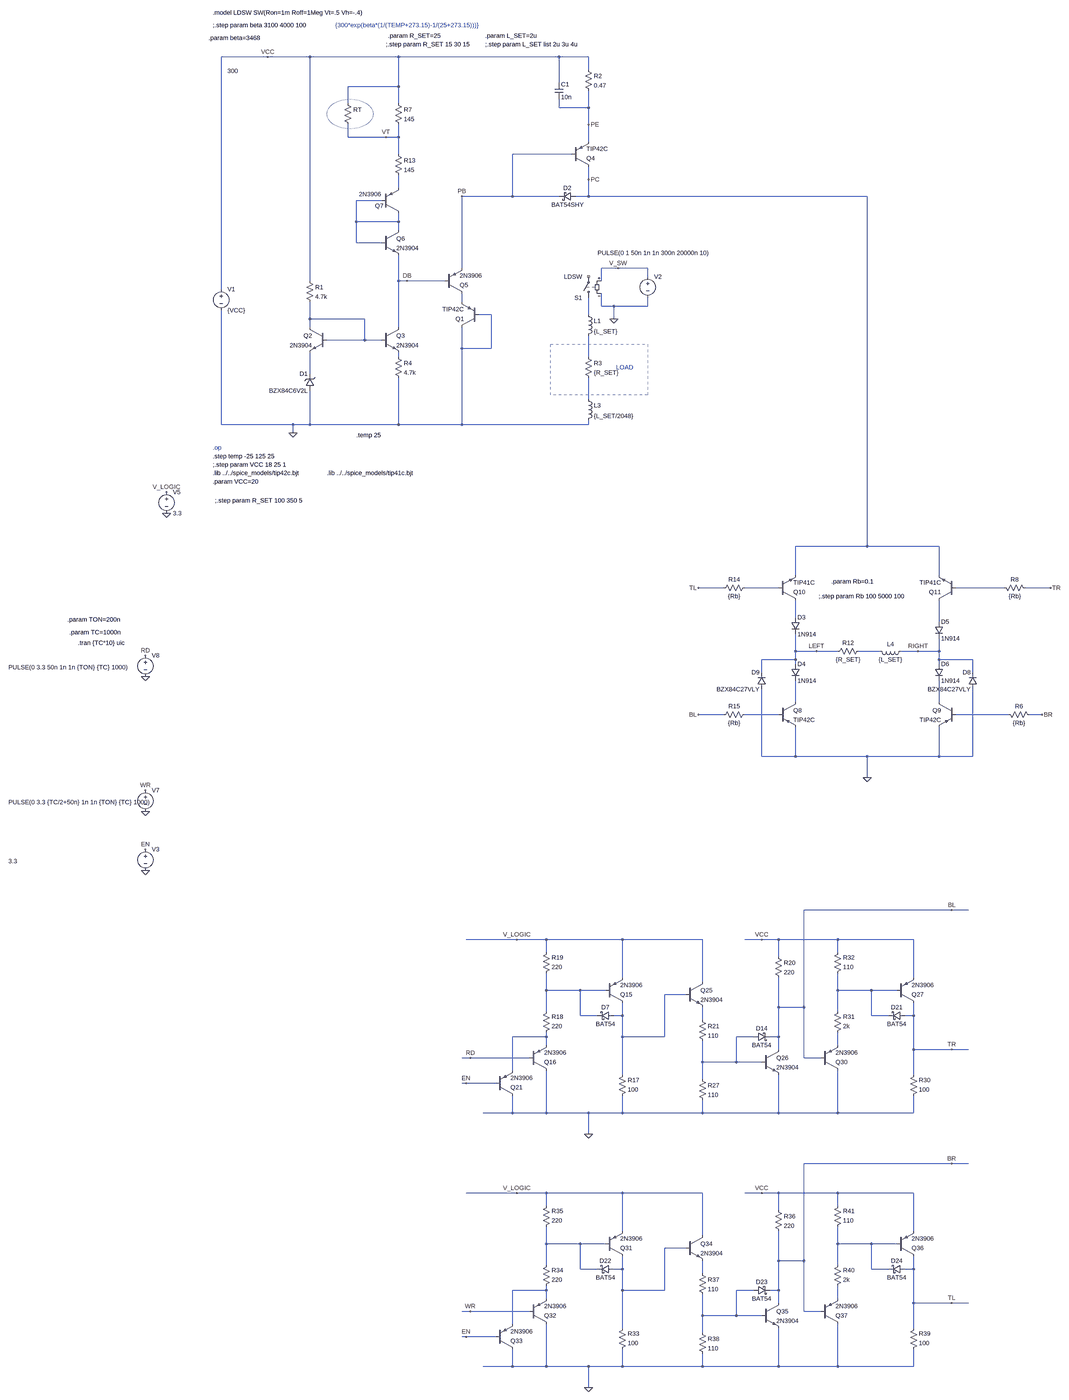
[diagram p0: schematic line_switch.asc, whole sheet]
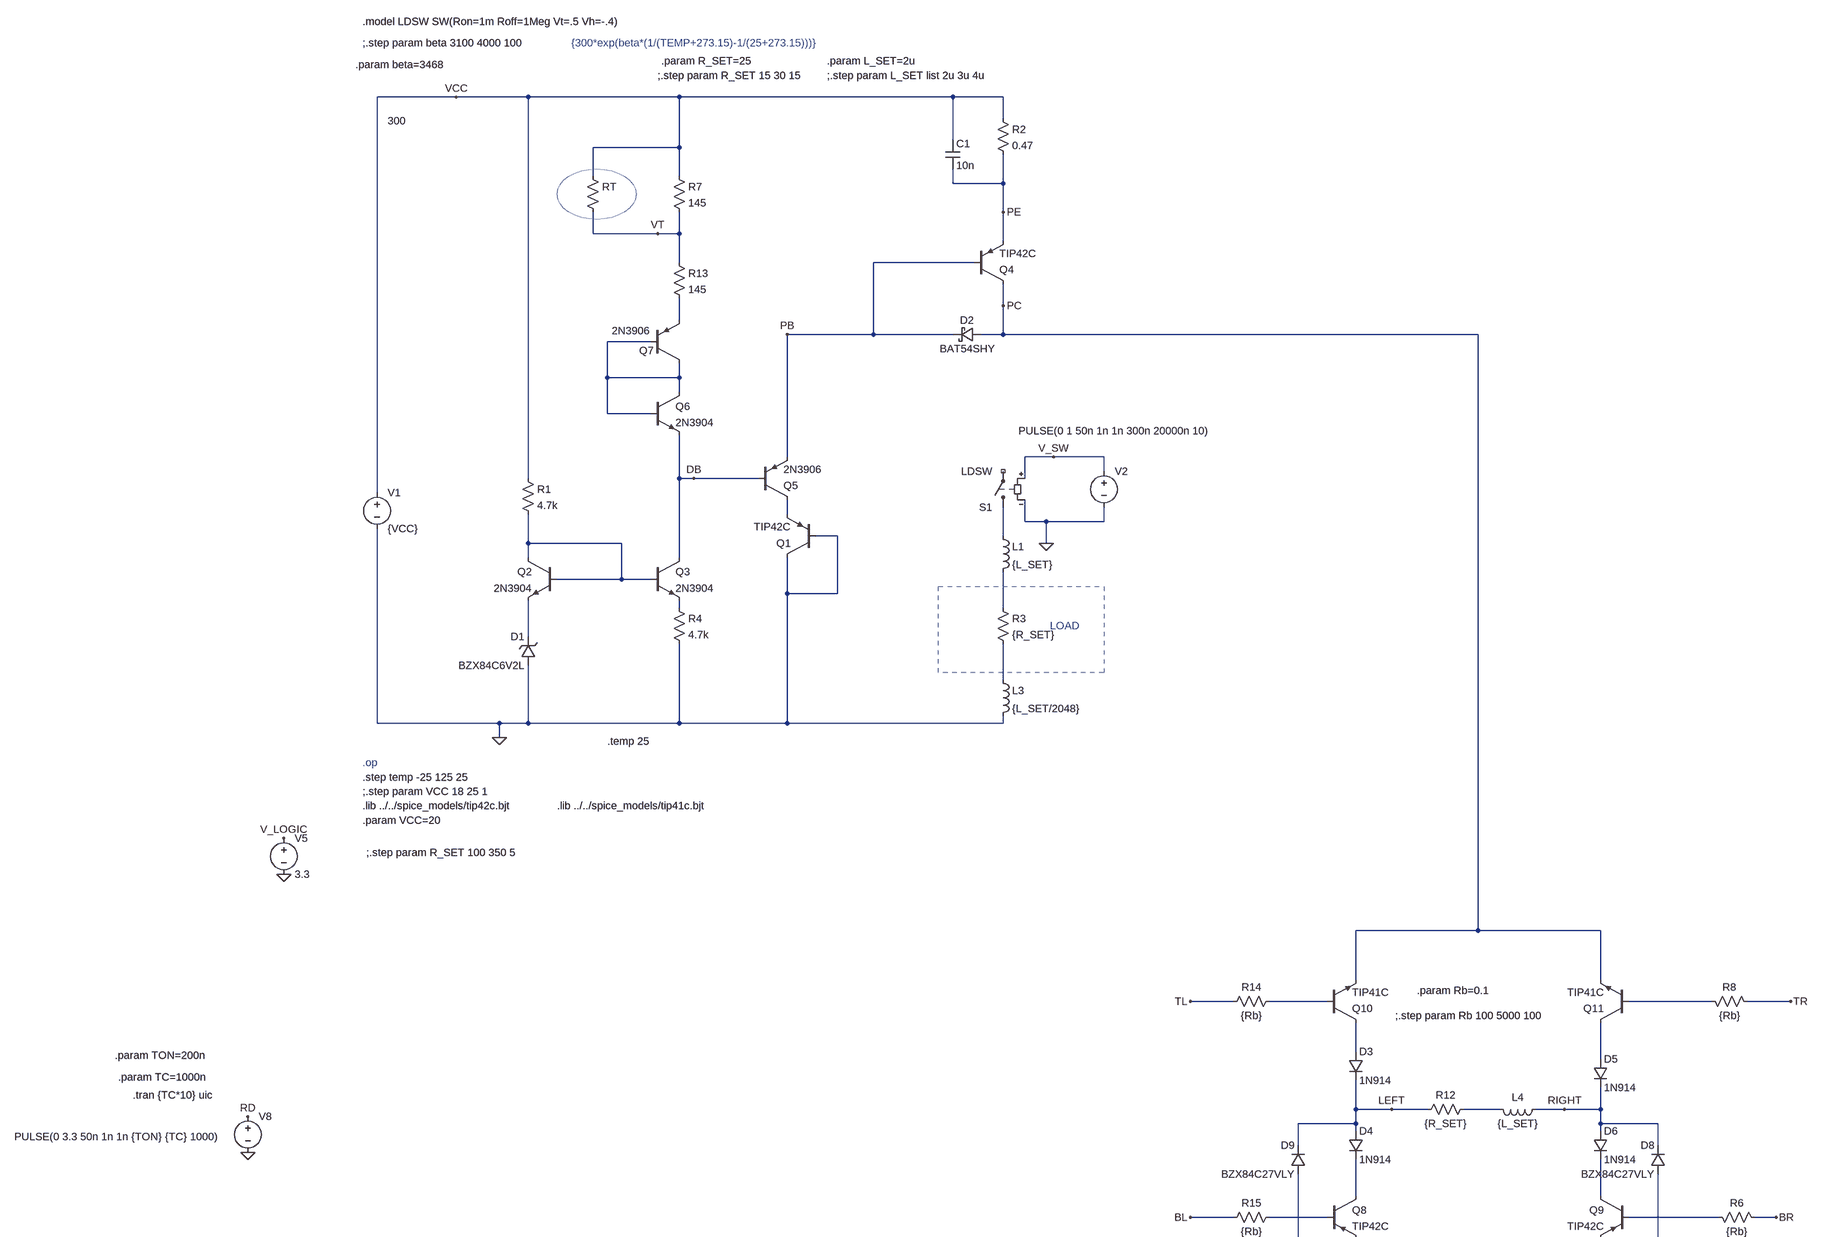
[diagram p1: schematic line_switch.asc, part, row 1 of 2, column 1 of 1]
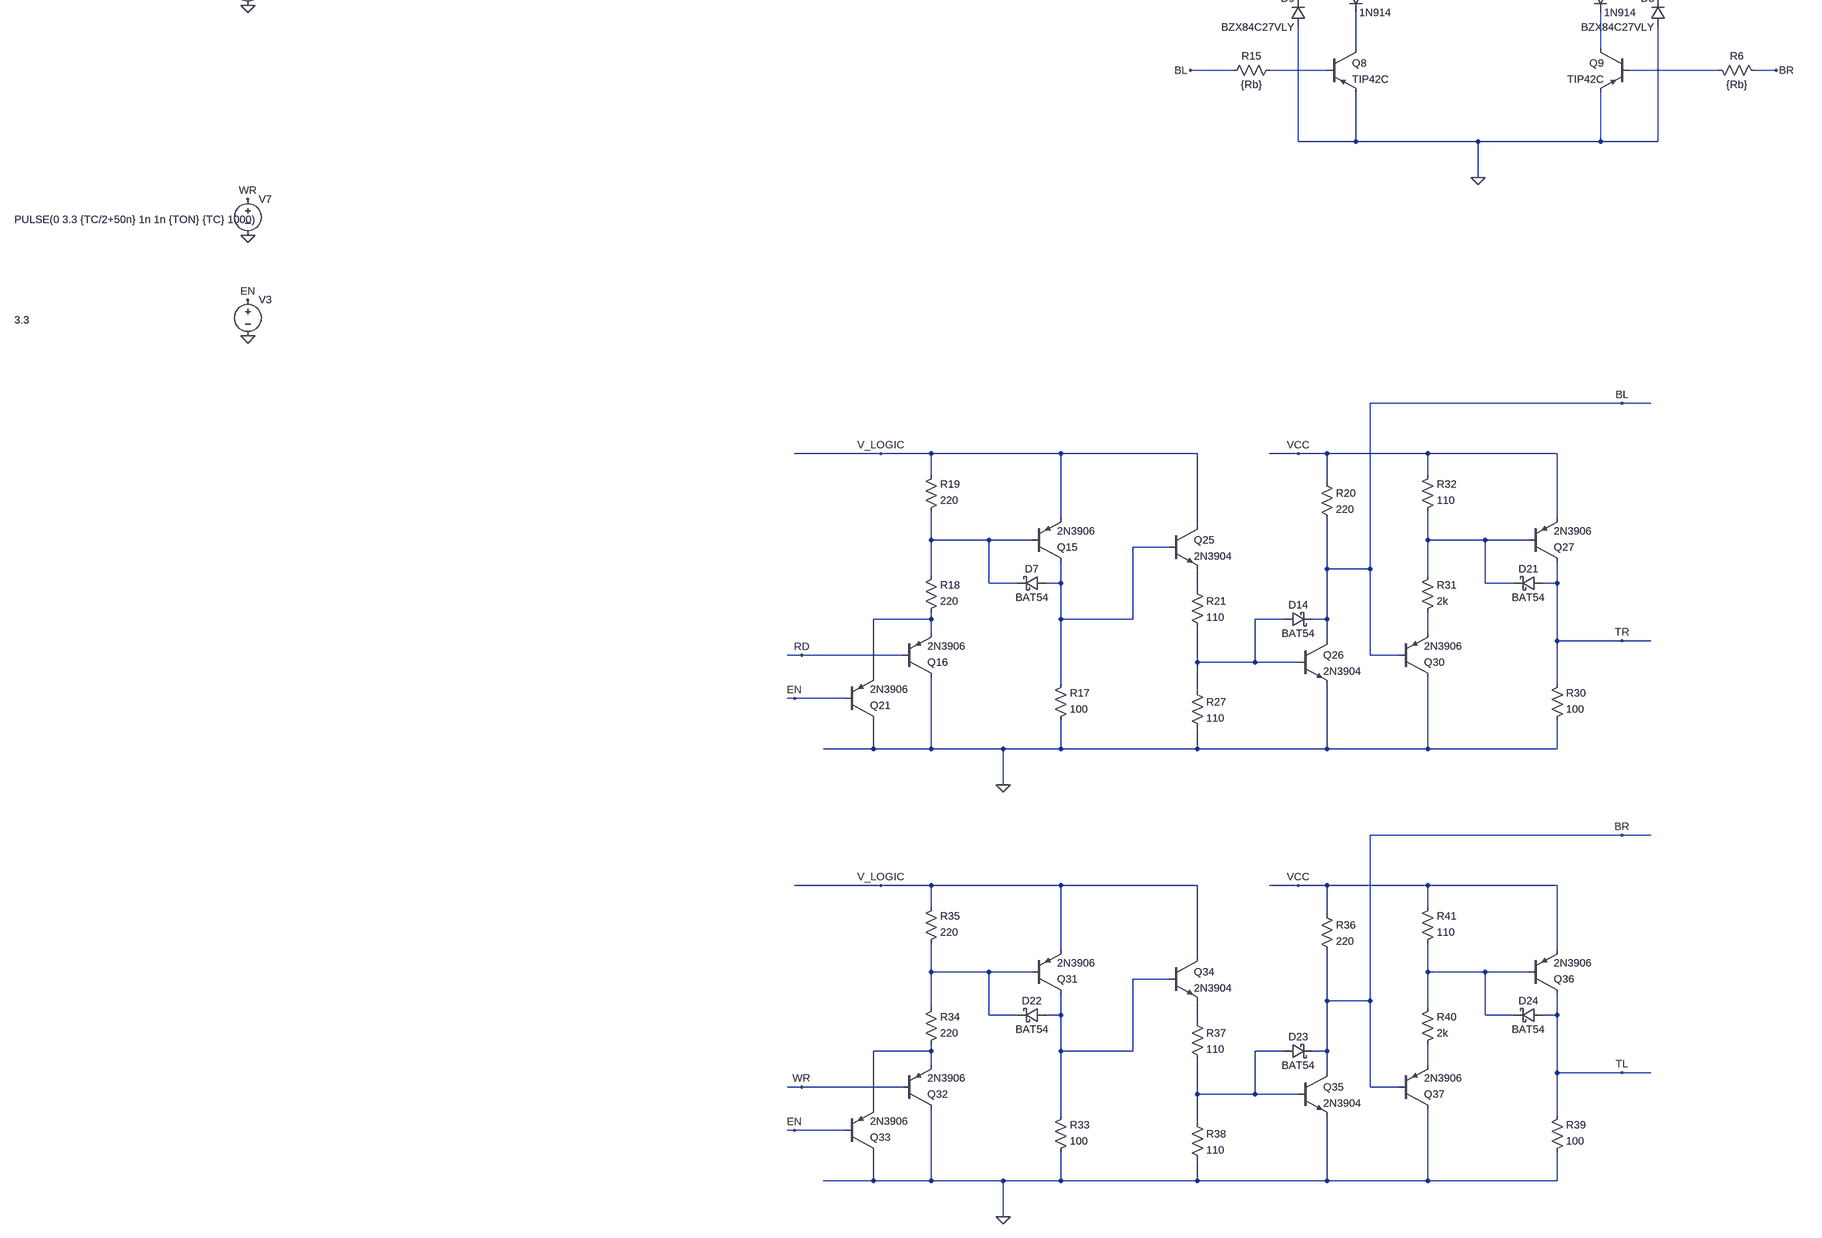
[diagram p2: schematic line_switch.asc, part, row 2 of 2, column 1 of 1]
line_switch.asc, the LTspice schematic file:
Version 4
SHEET 1 4220 5156
WIRE -2416 -1376 -2592 -1376
WIRE -2256 -1376 -2416 -1376
WIRE -1920 -1376 -2256 -1376
WIRE -1312 -1376 -1920 -1376
WIRE -1200 -1376 -1312 -1376
WIRE -1200 -1328 -1200 -1376
WIRE -1312 -1280 -1312 -1376
WIRE -1920 -1264 -1920 -1376
WIRE -1920 -1264 -2112 -1264
WIRE -2112 -1200 -2112 -1264
WIRE -1920 -1200 -1920 -1264
WIRE -1312 -1184 -1312 -1216
WIRE -1200 -1184 -1200 -1248
WIRE -1200 -1184 -1312 -1184
WIRE -1200 -1120 -1200 -1184
WIRE -2112 -1072 -2112 -1120
WIRE -1968 -1072 -2112 -1072
WIRE -1920 -1072 -1920 -1120
WIRE -1920 -1072 -1968 -1072
WIRE -1200 -1056 -1200 -1120
WIRE -1920 -1008 -1920 -1072
WIRE -1264 -1008 -1488 -1008
WIRE -1200 -912 -1200 -960
WIRE -1920 -880 -1920 -928
WIRE -1488 -848 -1488 -1008
WIRE -1488 -848 -1680 -848
WIRE -1312 -848 -1488 -848
WIRE -1200 -848 -1200 -912
WIRE -1200 -848 -1248 -848
WIRE -144 -848 -1200 -848
WIRE -1984 -832 -2080 -832
WIRE -2080 -752 -2080 -832
WIRE -1920 -752 -1920 -784
WIRE -1920 -752 -2080 -752
WIRE -1920 -720 -1920 -752
WIRE -2080 -672 -2080 -752
WIRE -1984 -672 -2080 -672
WIRE -1680 -576 -1680 -848
WIRE -1088 -576 -1152 -576
WIRE -976 -576 -1088 -576
WIRE -976 -544 -976 -576
WIRE -2256 -528 -2256 -1376
WIRE -1920 -528 -1920 -624
WIRE -1888 -528 -1920 -528
WIRE -1744 -528 -1888 -528
WIRE -1152 -528 -1152 -576
WIRE -2592 -496 -2592 -1376
WIRE -1680 -448 -1680 -480
WIRE -1152 -432 -1152 -480
WIRE -1104 -432 -1152 -432
WIRE -976 -432 -976 -464
WIRE -976 -432 -1104 -432
WIRE -1568 -400 -1616 -400
WIRE -1200 -400 -1200 -464
WIRE -2256 -384 -2256 -448
WIRE -2048 -384 -2256 -384
WIRE -1104 -384 -1104 -432
WIRE -2256 -352 -2256 -384
WIRE -1920 -352 -1920 -528
WIRE -2048 -304 -2048 -384
WIRE -2048 -304 -2192 -304
WIRE -1984 -304 -2048 -304
WIRE -1680 -272 -1680 -352
WIRE -1568 -272 -1568 -400
WIRE -1568 -272 -1680 -272
WIRE -1920 -240 -1920 -256
WIRE -1200 -240 -1200 -320
WIRE -2256 -176 -2256 -256
WIRE -1200 -80 -1200 -160
WIRE -2592 16 -2592 -416
WIRE -2320 16 -2592 16
WIRE -2256 16 -2256 -112
WIRE -2256 16 -2320 16
WIRE -1920 16 -1920 -160
WIRE -1920 16 -2256 16
WIRE -1680 16 -1680 -272
WIRE -1680 16 -1920 16
WIRE -1200 16 -1200 0
WIRE -1200 16 -1680 16
WIRE -2320 48 -2320 16
WIRE -144 1072 -144 -848
WIRE -144 1072 -416 1072
WIRE 128 1072 -144 1072
WIRE -416 1200 -416 1072
WIRE 128 1200 128 1072
WIRE -688 1248 -784 1248
WIRE -480 1248 -608 1248
WIRE 400 1248 192 1248
WIRE 576 1248 480 1248
WIRE -416 1360 -416 1296
WIRE 128 1376 128 1296
WIRE -416 1488 -416 1424
WIRE -336 1488 -416 1488
WIRE -256 1488 -336 1488
WIRE -96 1488 -176 1488
WIRE 48 1488 -16 1488
WIRE 128 1488 128 1440
WIRE 128 1488 48 1488
WIRE -416 1520 -416 1488
WIRE -416 1520 -544 1520
WIRE 128 1520 128 1488
WIRE 256 1520 128 1520
WIRE -416 1536 -416 1520
WIRE 128 1536 128 1520
WIRE -544 1568 -544 1520
WIRE 256 1568 256 1520
WIRE -416 1680 -416 1600
WIRE 128 1680 128 1600
WIRE -688 1728 -784 1728
WIRE -480 1728 -608 1728
WIRE 416 1728 192 1728
WIRE 544 1728 496 1728
WIRE -544 1888 -544 1632
WIRE -416 1888 -416 1776
WIRE -416 1888 -544 1888
WIRE -144 1888 -416 1888
WIRE 128 1888 128 1776
WIRE 128 1888 -144 1888
WIRE 256 1888 256 1632
WIRE 256 1888 128 1888
WIRE -144 1968 -144 1888
WIRE 176 3328 -384 3328
WIRE 240 3328 176 3328
WIRE -1472 3440 -1664 3440
WIRE -1360 3440 -1472 3440
WIRE -1072 3440 -1360 3440
WIRE -768 3440 -1072 3440
WIRE -544 3440 -608 3440
WIRE -480 3440 -544 3440
WIRE -256 3440 -480 3440
WIRE 32 3440 -256 3440
WIRE -1360 3488 -1360 3440
WIRE -256 3488 -256 3440
WIRE -480 3504 -480 3440
WIRE -1072 3584 -1072 3440
WIRE 32 3584 32 3440
WIRE -768 3600 -768 3440
WIRE -1360 3632 -1360 3568
WIRE -1232 3632 -1360 3632
WIRE -1136 3632 -1232 3632
WIRE -256 3632 -256 3568
WIRE -128 3632 -256 3632
WIRE -32 3632 -128 3632
WIRE -832 3648 -912 3648
WIRE -480 3696 -480 3584
WIRE -384 3696 -384 3328
WIRE -384 3696 -480 3696
WIRE -1360 3712 -1360 3632
WIRE -256 3712 -256 3632
WIRE -1232 3728 -1232 3632
WIRE -1168 3728 -1232 3728
WIRE -1072 3728 -1072 3680
WIRE -1072 3728 -1104 3728
WIRE -128 3728 -128 3632
WIRE -64 3728 -128 3728
WIRE 32 3728 32 3680
WIRE 32 3728 0 3728
WIRE -768 3744 -768 3696
WIRE -1360 3808 -1360 3792
WIRE -1360 3808 -1488 3808
WIRE -1072 3808 -1072 3728
WIRE -912 3808 -912 3648
WIRE -912 3808 -1072 3808
WIRE -576 3808 -640 3808
WIRE -480 3808 -480 3696
WIRE -480 3808 -512 3808
WIRE -1360 3840 -1360 3808
WIRE -256 3840 -256 3792
WIRE -480 3856 -480 3808
WIRE 32 3856 32 3728
WIRE 176 3856 32 3856
WIRE 240 3856 176 3856
WIRE -1648 3888 -1680 3888
WIRE -1424 3888 -1648 3888
WIRE -384 3888 -384 3696
WIRE -320 3888 -384 3888
WIRE -768 3904 -768 3824
WIRE -640 3904 -640 3808
WIRE -640 3904 -768 3904
WIRE -544 3904 -640 3904
WIRE -1488 3936 -1488 3808
WIRE -1072 3952 -1072 3808
WIRE 32 3952 32 3856
WIRE -768 3968 -768 3904
WIRE -1664 3984 -1680 3984
WIRE -1552 3984 -1664 3984
WIRE -1488 4096 -1488 4032
WIRE -1488 4096 -1600 4096
WIRE -1360 4096 -1360 3936
WIRE -1360 4096 -1488 4096
WIRE -1200 4096 -1360 4096
WIRE -1072 4096 -1072 4032
WIRE -1072 4096 -1200 4096
WIRE -768 4096 -768 4048
WIRE -768 4096 -1072 4096
WIRE -480 4096 -480 3952
WIRE -480 4096 -768 4096
WIRE -256 4096 -256 3936
WIRE -256 4096 -480 4096
WIRE 32 4096 32 4032
WIRE 32 4096 -256 4096
WIRE -1200 4176 -1200 4096
WIRE 176 4288 -384 4288
WIRE 240 4288 176 4288
WIRE -1472 4400 -1664 4400
WIRE -1360 4400 -1472 4400
WIRE -1072 4400 -1360 4400
WIRE -768 4400 -1072 4400
WIRE -544 4400 -608 4400
WIRE -480 4400 -544 4400
WIRE -256 4400 -480 4400
WIRE 32 4400 -256 4400
WIRE -1360 4448 -1360 4400
WIRE -256 4448 -256 4400
WIRE -480 4464 -480 4400
WIRE -1072 4544 -1072 4400
WIRE 32 4544 32 4400
WIRE -768 4560 -768 4400
WIRE -1360 4592 -1360 4528
WIRE -1232 4592 -1360 4592
WIRE -1136 4592 -1232 4592
WIRE -256 4592 -256 4528
WIRE -128 4592 -256 4592
WIRE -32 4592 -128 4592
WIRE -832 4608 -912 4608
WIRE -480 4656 -480 4544
WIRE -384 4656 -384 4288
WIRE -384 4656 -480 4656
WIRE -1360 4672 -1360 4592
WIRE -256 4672 -256 4592
WIRE -1232 4688 -1232 4592
WIRE -1168 4688 -1232 4688
WIRE -1072 4688 -1072 4640
WIRE -1072 4688 -1104 4688
WIRE -128 4688 -128 4592
WIRE -64 4688 -128 4688
WIRE 32 4688 32 4640
WIRE 32 4688 0 4688
WIRE -768 4704 -768 4656
WIRE -1360 4768 -1360 4752
WIRE -1360 4768 -1488 4768
WIRE -1072 4768 -1072 4688
WIRE -912 4768 -912 4608
WIRE -912 4768 -1072 4768
WIRE -576 4768 -640 4768
WIRE -480 4768 -480 4656
WIRE -480 4768 -512 4768
WIRE -1360 4800 -1360 4768
WIRE -256 4800 -256 4752
WIRE -480 4816 -480 4768
WIRE 32 4816 32 4688
WIRE 176 4816 32 4816
WIRE 240 4816 176 4816
WIRE -1648 4848 -1680 4848
WIRE -1424 4848 -1648 4848
WIRE -384 4848 -384 4656
WIRE -320 4848 -384 4848
WIRE -768 4864 -768 4784
WIRE -640 4864 -640 4768
WIRE -640 4864 -768 4864
WIRE -544 4864 -640 4864
WIRE -1488 4896 -1488 4768
WIRE -1072 4912 -1072 4768
WIRE 32 4912 32 4816
WIRE -768 4928 -768 4864
WIRE -1664 4944 -1680 4944
WIRE -1552 4944 -1664 4944
WIRE -1488 5056 -1488 4992
WIRE -1488 5056 -1600 5056
WIRE -1360 5056 -1360 4896
WIRE -1360 5056 -1488 5056
WIRE -1200 5056 -1360 5056
WIRE -1072 5056 -1072 4992
WIRE -1072 5056 -1200 5056
WIRE -768 5056 -768 5008
WIRE -768 5056 -1072 5056
WIRE -480 5056 -480 4912
WIRE -480 5056 -768 5056
WIRE -256 5056 -256 4896
WIRE -256 5056 -480 5056
WIRE 32 5056 32 4992
WIRE 32 5056 -256 5056
WIRE -1200 5136 -1200 5056
FLAG -2320 48 0
FLAG -1200 -1120 PE
FLAG -1200 -912 PC
FLAG -1968 -1072 VT
FLAG -2416 -1376 VCC
FLAG -1680 -848 PB
FLAG -1888 -528 DB
FLAG -1104 -384 0
FLAG -1088 -576 V_SW
FLAG -144 1968 0
FLAG -2976 352 0
FLAG -2976 272 V_LOGIC
FLAG -3056 2016 WR
FLAG -3056 2096 0
FLAG -3056 1504 RD
FLAG -3056 1584 0
FLAG -3056 2240 EN
FLAG -3056 2320 0
FLAG -1648 3888 RD
FLAG -1472 3440 V_LOGIC
FLAG -1664 3984 EN
FLAG -544 3440 VCC
FLAG -1200 4176 0
FLAG 176 3328 BL
FLAG 176 3856 TR
FLAG -1648 4848 WR
FLAG -1472 4400 V_LOGIC
FLAG -1664 4944 EN
FLAG -544 4400 VCC
FLAG -1200 5136 0
FLAG 176 4288 BR
FLAG 176 4816 TL
FLAG -784 1248 TL
FLAG -784 1728 BL
FLAG 576 1248 TR
FLAG 544 1728 BR
FLAG -336 1488 LEFT
FLAG 48 1488 RIGHT
SYMBOL npn -2192 -352 M0
SYMATTR InstName Q2
SYMATTR Value 2N3904
SYMBOL zener -2240 -112 R180
WINDOW 0 24 64 Left 2
WINDOW 3 24 0 Left 2
SYMATTR InstName D1
SYMATTR Value BZX84C6V2L
SYMBOL res -2272 -544 R0
SYMATTR InstName R1
SYMATTR Value 4.7k
SYMBOL res -1216 -1344 R0
SYMATTR InstName R2
SYMATTR Value 0.47
SYMBOL res -1216 -256 R0
SYMATTR InstName R3
SYMATTR Value {R_SET}
SYMBOL voltage -2592 -512 R0
SYMATTR InstName V1
SYMATTR Value {VCC}
SYMBOL npn -1984 -352 R0
SYMATTR InstName Q3
SYMATTR Value 2N3904
SYMBOL res -1936 -256 R0
SYMATTR InstName R4
SYMATTR Value 4.7k
SYMBOL pnp -1264 -960 M180
SYMATTR InstName Q4
SYMATTR Value TIP42C
SYMBOL pnp -1744 -480 M180
SYMATTR InstName Q5
SYMATTR Value 2N3906
SYMBOL pnp -1984 -784 M180
WINDOW 0 -25 28 Left 2
WINDOW 3 -86 72 Left 2
SYMATTR InstName Q7
SYMATTR Value 2N3906
SYMBOL npn -1984 -720 R0
SYMATTR InstName Q6
SYMATTR Value 2N3904
SYMBOL res -1936 -1216 R0
SYMATTR InstName R7
SYMATTR Value 145
SYMBOL res -1936 -1024 R0
SYMATTR InstName R13
SYMATTR Value 145
SYMBOL res -2128 -1216 R0
WINDOW 3 -440 -107 Left 2
SYMATTR Value 300
SYMATTR InstName RT
SYMBOL pnp -1616 -352 R180
SYMATTR InstName Q1
SYMATTR Value TIP42C
SYMBOL sw -1200 -448 R180
SYMATTR InstName S1
SYMATTR Value LDSW
SYMBOL voltage -976 -560 R0
WINDOW 123 0 0 Left 0
WINDOW 39 0 0 Left 0
WINDOW 3 -190 -74 Left 2
SYMATTR Value PULSE(0 1 50n 1n 1n 300n 20000n 10)
SYMATTR InstName V2
SYMBOL schottky -1248 -864 R90
WINDOW 0 0 32 VBottom 2
WINDOW 3 32 32 VTop 2
SYMATTR InstName D2
SYMATTR Value BAT54SHY
SYMATTR Description Diode
SYMATTR Type diode
SYMBOL ind -1216 -416 R0
SYMATTR InstName L1
SYMATTR Value {L_SET}
SYMBOL ind -1216 -96 R0
SYMATTR InstName L3
SYMATTR Value {L_SET/2048}
SYMBOL res -160 1472 R90
WINDOW 0 0 56 VBottom 2
WINDOW 3 32 56 VTop 2
SYMATTR InstName R12
SYMATTR Value {R_SET}
SYMBOL ind 0 1472 R90
WINDOW 0 5 56 VBottom 2
WINDOW 3 32 56 VTop 2
SYMATTR InstName L4
SYMATTR Value {L_SET}
SYMBOL res -592 1712 R90
WINDOW 0 0 56 VBottom 2
WINDOW 3 32 56 VTop 2
SYMATTR InstName R15
SYMATTR Value {Rb}
SYMBOL res -592 1232 R90
WINDOW 0 0 56 VBottom 2
WINDOW 3 32 56 VTop 2
SYMATTR InstName R14
SYMATTR Value {Rb}
SYMBOL voltage -2976 256 R0
SYMATTR InstName V5
SYMATTR Value 3.3
SYMBOL voltage -3056 2000 R0
WINDOW 123 0 0 Left 0
WINDOW 39 0 0 Left 0
WINDOW 3 -519 61 Left 2
SYMATTR Value PULSE(0 3.3 {TC/2+50n} 1n 1n {TON} {TC} 1000)
SYMATTR InstName V7
SYMBOL voltage -3056 1488 R0
WINDOW 123 0 0 Left 0
WINDOW 39 0 0 Left 0
WINDOW 3 -519 61 Left 2
SYMATTR Value PULSE(0 3.3 50n 1n 1n {TON} {TC} 1000)
SYMATTR InstName V8
SYMBOL voltage -3056 2224 R0
WINDOW 123 0 0 Left 0
WINDOW 39 0 0 Left 0
WINDOW 3 -519 61 Left 2
SYMATTR Value 3.3
SYMATTR InstName V3
SYMBOL res 400 1712 M90
WINDOW 0 0 56 VBottom 2
WINDOW 3 32 56 VTop 2
SYMATTR InstName R6
SYMATTR Value {Rb}
SYMBOL res 384 1232 M90
WINDOW 0 0 56 VBottom 2
WINDOW 3 32 56 VTop 2
SYMATTR InstName R8
SYMATTR Value {Rb}
SYMBOL schottky -1104 3744 M270
WINDOW 0 32 32 VTop 2
WINDOW 3 0 32 VBottom 2
SYMATTR InstName D7
SYMATTR Value BAT54
SYMATTR Description Diode
SYMATTR Type diode
SYMBOL res -1088 4048 M180
WINDOW 0 36 76 Left 2
WINDOW 3 36 40 Left 2
SYMATTR InstName R17
SYMATTR Value 100
SYMBOL res -1376 3808 M180
WINDOW 0 36 76 Left 2
WINDOW 3 36 40 Left 2
SYMATTR InstName R18
SYMATTR Value 220
SYMBOL res -1376 3584 M180
WINDOW 0 36 76 Left 2
WINDOW 3 36 40 Left 2
SYMATTR InstName R19
SYMATTR Value 220
SYMBOL pnp -1136 3680 M180
SYMATTR InstName Q15
SYMATTR Value 2N3906
SYMBOL pnp -1424 3936 M180
SYMATTR InstName Q16
SYMATTR Value 2N3906
SYMBOL pnp -1552 4032 M180
SYMATTR InstName Q21
SYMATTR Value 2N3906
SYMBOL schottky -576 3792 M90
WINDOW 0 0 32 VBottom 2
WINDOW 3 32 32 VTop 2
SYMATTR InstName D14
SYMATTR Value BAT54
SYMATTR Description Diode
SYMATTR Type diode
SYMBOL res -496 3488 R0
SYMATTR InstName R20
SYMATTR Value 220
SYMBOL res -784 3728 R0
SYMATTR InstName R21
SYMATTR Value 110
SYMBOL res -784 3952 R0
SYMATTR InstName R27
SYMATTR Value 110
SYMBOL npn -832 3600 R0
SYMATTR InstName Q25
SYMATTR Value 2N3904
SYMBOL npn -544 3856 R0
SYMATTR InstName Q26
SYMATTR Value 2N3904
SYMBOL schottky 0 3744 M270
WINDOW 0 32 32 VTop 2
WINDOW 3 0 32 VBottom 2
SYMATTR InstName D21
SYMATTR Value BAT54
SYMATTR Description Diode
SYMATTR Type diode
SYMBOL res 16 4048 M180
WINDOW 0 36 76 Left 2
WINDOW 3 36 40 Left 2
SYMATTR InstName R30
SYMATTR Value 100
SYMBOL res -272 3808 M180
WINDOW 0 36 76 Left 2
WINDOW 3 36 40 Left 2
SYMATTR InstName R31
SYMATTR Value 2k
SYMBOL res -272 3584 M180
WINDOW 0 36 76 Left 2
WINDOW 3 36 40 Left 2
SYMATTR InstName R32
SYMATTR Value 110
SYMBOL pnp -32 3680 M180
SYMATTR InstName Q27
SYMATTR Value 2N3906
SYMBOL pnp -320 3936 M180
SYMATTR InstName Q30
SYMATTR Value 2N3906
SYMBOL schottky -1104 4704 M270
WINDOW 0 32 32 VTop 2
WINDOW 3 0 32 VBottom 2
SYMATTR InstName D22
SYMATTR Value BAT54
SYMATTR Description Diode
SYMATTR Type diode
SYMBOL res -1088 5008 M180
WINDOW 0 36 76 Left 2
WINDOW 3 36 40 Left 2
SYMATTR InstName R33
SYMATTR Value 100
SYMBOL res -1376 4768 M180
WINDOW 0 36 76 Left 2
WINDOW 3 36 40 Left 2
SYMATTR InstName R34
SYMATTR Value 220
SYMBOL res -1376 4544 M180
WINDOW 0 36 76 Left 2
WINDOW 3 36 40 Left 2
SYMATTR InstName R35
SYMATTR Value 220
SYMBOL pnp -1136 4640 M180
SYMATTR InstName Q31
SYMATTR Value 2N3906
SYMBOL pnp -1424 4896 M180
SYMATTR InstName Q32
SYMATTR Value 2N3906
SYMBOL pnp -1552 4992 M180
SYMATTR InstName Q33
SYMATTR Value 2N3906
SYMBOL schottky -576 4752 M90
WINDOW 0 0 32 VBottom 2
WINDOW 3 32 32 VTop 2
SYMATTR InstName D23
SYMATTR Value BAT54
SYMATTR Description Diode
SYMATTR Type diode
SYMBOL res -496 4448 R0
SYMATTR InstName R36
SYMATTR Value 220
SYMBOL res -784 4688 R0
SYMATTR InstName R37
SYMATTR Value 110
SYMBOL res -784 4912 R0
SYMATTR InstName R38
SYMATTR Value 110
SYMBOL npn -832 4560 R0
SYMATTR InstName Q34
SYMATTR Value 2N3904
SYMBOL npn -544 4816 R0
SYMATTR InstName Q35
SYMATTR Value 2N3904
SYMBOL schottky 0 4704 M270
WINDOW 0 32 32 VTop 2
WINDOW 3 0 32 VBottom 2
SYMATTR InstName D24
SYMATTR Value BAT54
SYMATTR Description Diode
SYMATTR Type diode
SYMBOL res 16 5008 M180
WINDOW 0 36 76 Left 2
WINDOW 3 36 40 Left 2
SYMATTR InstName R39
SYMATTR Value 100
SYMBOL res -272 4768 M180
WINDOW 0 36 76 Left 2
WINDOW 3 36 40 Left 2
SYMATTR InstName R40
SYMATTR Value 2k
SYMBOL res -272 4544 M180
WINDOW 0 36 76 Left 2
WINDOW 3 36 40 Left 2
SYMATTR InstName R41
SYMATTR Value 110
SYMBOL pnp -32 4640 M180
SYMATTR InstName Q36
SYMATTR Value 2N3906
SYMBOL pnp -320 4896 M180
SYMATTR InstName Q37
SYMATTR Value 2N3906
SYMBOL cap -1328 -1280 R0
SYMATTR InstName C1
SYMATTR Value 10n
SYMBOL diode -432 1360 R0
SYMATTR InstName D3
SYMATTR Value 1N914
SYMBOL diode -432 1536 R0
SYMATTR InstName D4
SYMATTR Value 1N914
SYMBOL diode 112 1376 R0
SYMATTR InstName D5
SYMATTR Value 1N914
SYMBOL diode 112 1536 R0
SYMATTR InstName D6
SYMATTR Value 1N914
SYMBOL diode 272 1632 R180
WINDOW 0 24 64 Left 2
WINDOW 3 24 0 Left 2
SYMATTR InstName D8
SYMATTR Value BZX84C27VLY
SYMBOL diode -528 1632 R180
WINDOW 0 24 64 Left 2
WINDOW 3 24 0 Left 2
SYMATTR InstName D9
SYMATTR Value BZX84C27VLY
SYMBOL pnp -480 1680 R0
SYMATTR InstName Q8
SYMATTR Value TIP42C
SYMBOL pnp 192 1680 M0
SYMATTR InstName Q9
SYMATTR Value TIP42C
SYMBOL npn -480 1296 M180
SYMATTR InstName Q10
SYMATTR Value TIP41C
SYMBOL npn 192 1296 R180
SYMATTR InstName Q11
SYMATTR Value TIP41C
TEXT -3312 1456 Left 2 !.tran {TC*10} uic
TEXT -2624 136 Left 2 !.step temp -25 125 25
TEXT -1096 -200 Left 2 ;LOAD
TEXT -2624 104 Left 2 ;.op
TEXT -2624 168 Left 2 !;.step param VCC 18 25 1
TEXT -2624 200 Left 2 !.lib ../../spice_models/tip42c.bjt
TEXT -2624 232 Left 2 !.param VCC=20
TEXT -2616 304 Left 2 !;.step param R_SET 100 350 5
TEXT -2640 -1448 Left 2 !.param beta=3468
TEXT -2624 -1496 Left 2 !;.step param beta 3100 4000 100
TEXT -2160 -1496 Left 2 ;{300*exp(beta*(1/(TEMP+273.15)-1/(25+273.15)))}
TEXT -1968 -1424 Left 2 !;.step param R_SET 15 30 15
TEXT -2624 -1544 Left 2 !.model LDSW SW(Ron=1m Roff=1Meg Vt=.5 Vh=-.4)
TEXT -2080 56 Left 2 !.temp 25
TEXT -1592 -1424 Left 2 !;.step param L_SET list 2u 3u 4u
TEXT -2192 200 Left 2 !.lib ../../spice_models/tip41c.bjt
TEXT -1592 -1456 Left 2 !.param L_SET=2u
TEXT -1960 -1456 Left 2 !.param R_SET=25
TEXT -280 1224 Left 2 !.param Rb=0.1
TEXT -3352 1368 Left 2 !.param TON=200n
TEXT -3344 1416 Left 2 !.param TC=1000n
TEXT -328 1280 Left 2 !;.step param Rb 100 5000 100
RECTANGLE Normal -976 -96 -1344 -288 2
CIRCLE Normal -2016 -1104 -2192 -1216 2

The netlist it stands for:
* line_switch.asc
Q2 N005 N005 N008 0 2N3904
D1 0 N008 BZX84C6V2L
R1 VCC N005 4.7k
R2 VCC PE 0.47
R3 N007 N009 {R_SET}
V1 VCC 0 {VCC}
Q3 DB N005 N006 0 2N3904
R4 N006 0 4.7k
Q4 PC PB PE 0 TIP42C
Q5 N003 DB PB 0 2N3906
Q7 N002 N002 N001 0 2N3906
Q6 N002 N002 DB 0 2N3904
R7 VCC VT 145
R13 VT N001 145
RT VCC VT 300
Q1 0 0 N003 0 TIP42C
S1 N004 NC_01 V_SW 0 LDSW
V2 V_SW 0 PULSE(0 1 50n 1n 1n 300n 20000n 10)
D2 PC PB BAT54SHY
L1 N004 N007 {L_SET}
L3 N009 0 {L_SET/2048}
R12 N014 LEFT {R_SET}
L4 RIGHT N014 {L_SET}
R15 N017 BL {Rb}
R14 N010 TL {Rb}
V5 V_LOGIC 0 3.3
V7 WR 0 PULSE(0 3.3 {TC/2+50n} 1n 1n {TON} {TC} 1000)
V8 RD 0 PULSE(0 3.3 50n 1n 1n {TON} {TC} 1000)
V3 EN 0 3.3
R6 N018 BR {Rb}
R8 N011 TR {Rb}
D7 N021 N019 BAT54
R17 0 N021 100
R18 N023 N019 220
R19 N019 V_LOGIC 220
Q15 N021 N019 V_LOGIC 0 2N3906
Q16 0 RD N023 0 2N3906
Q21 0 EN N023 0 2N3906
D14 N024 BL BAT54
R20 VCC BL 220
R21 N022 N024 110
R27 N024 0 110
Q25 V_LOGIC N021 N022 0 2N3904
Q26 BL N024 0 0 2N3904
D21 TR N020 BAT54
R30 0 TR 100
R31 N025 N020 2k
R32 N020 VCC 110
Q27 TR N020 VCC 0 2N3906
Q30 0 BL N025 0 2N3906
D22 N028 N026 BAT54
R33 0 N028 100
R34 N030 N026 220
R35 N026 V_LOGIC 220
Q31 N028 N026 V_LOGIC 0 2N3906
Q32 0 WR N030 0 2N3906
Q33 0 EN N030 0 2N3906
D23 N031 BR BAT54
R36 VCC BR 220
R37 N029 N031 110
R38 N031 0 110
Q34 V_LOGIC N028 N029 0 2N3904
Q35 BR N031 0 0 2N3904
D24 TL N027 BAT54
R39 0 TL 100
R40 N032 N027 2k
R41 N027 VCC 110
Q36 TL N027 VCC 0 2N3906
Q37 0 BR N032 0 2N3906
C1 VCC PE 10n
D3 N012 LEFT 1N914
D4 LEFT N015 1N914
D5 N013 RIGHT 1N914
D6 RIGHT N016 1N914
D8 0 RIGHT BZX84C27VLY
D9 0 LEFT BZX84C27VLY
Q8 N015 N017 0 0 TIP42C
Q9 N016 N018 0 0 TIP42C
Q10 N012 N010 PC 0 TIP41C
Q11 N013 N011 PC 0 TIP41C
.model D D
.lib standard.dio
.model NPN NPN
.model PNP PNP
.lib standard.bjt
.tran {TC*10} uic
.step temp -25 125 25
* LOAD
* .op
;.step param VCC 18 25 1
.lib ../../spice_models/tip42c.bjt
.param VCC=20
;.step param R_SET 100 350 5
.param beta=3468
;.step param beta 3100 4000 100
* {300*exp(beta*(1/(TEMP+273.15)-1/(25+273.15)))}
;.step param R_SET 15 30 15
.model LDSW SW(Ron=1m Roff=1Meg Vt=.5 Vh=-.4)
.temp 25
;.step param L_SET list 2u 3u 4u
.lib ../../spice_models/tip41c.bjt
.param L_SET=2u
.param R_SET=25
.param Rb=0.1
.param TON=200n
.param TC=1000n
;.step param Rb 100 5000 100
.backanno
.end